# EAGLE schematic button (EAGLE 6.5.0)
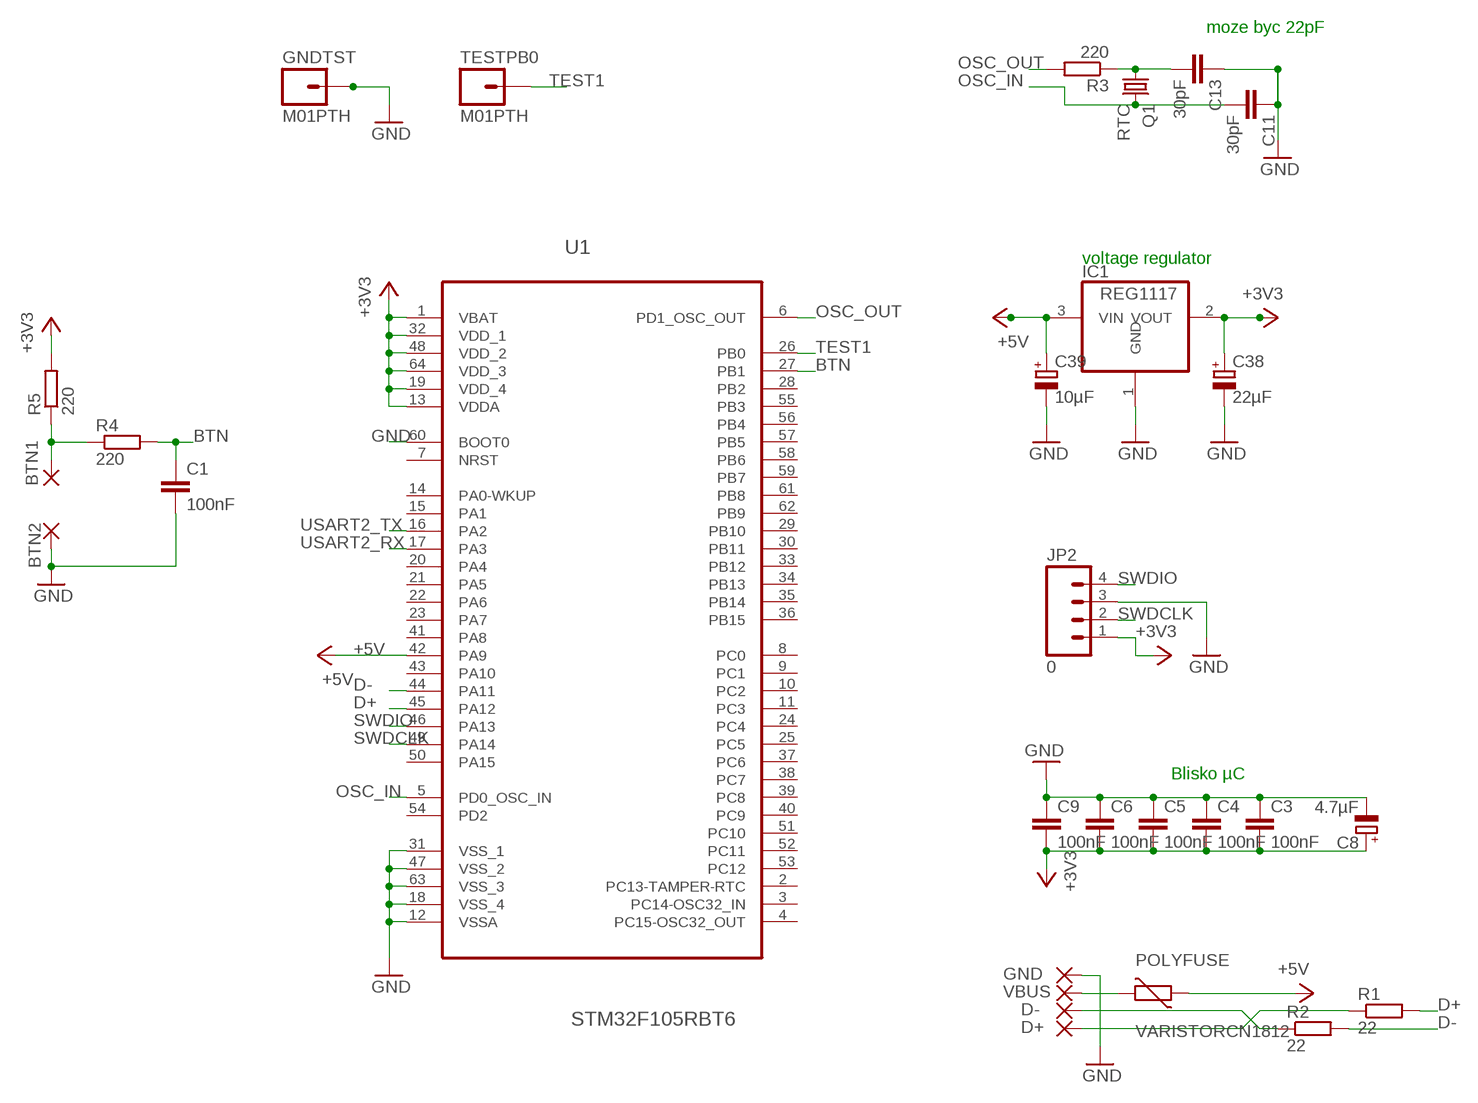
[diagram p0: schematic, sheet 1]

## Parts
BTN1  1,6/0,8  [1,6/0,8]
BTN2  1,6/0,8  [1,6/0,8]
C1  100nF  C-EUC0603  [C0603]
C3  100nF  C-EUC0603  [C0603]
C4  100nF  C-EUC0603  [C0603]
C5  100nF  C-EUC0603  [C0603]
C6  100nF  C-EUC0603  [C0603]
C8  4.7µF  CPOL-EUA/3216-18R  [A/3216-18R]
C9  100nF  C-EUC0603  [C0603]
C11  30pF  C-EUC0603  [C0603]
C13  30pF  C-EUC0603  [C0603]
C38  22µF  CPOL-EUB/3528-21W  [B/3528-21W]
C39  10µF  CPOL-EUB/3528-21W  [B/3528-21W]
D+  1,6/0,8  [1,6/0,8]
D-  1,6/0,8  [1,6/0,8]
GND  1,6/0,8  [1,6/0,8]
GNDTST  M01PTH  [1X01]
IC1  REG1117  [SOT223]
JP2  0  M04PTH  [1X04]
POLYFUSE  VARISTORCN1812  [CT/CN1812]
Q1  RTC  CRYSTALHC49S  [HC49/S]
R1  22  R-EU_R0805  [R0805]
R2  22  R-EU_R0805  [R0805]
R3  220  R-EU_R0603  [R0603]
R4  220  R-EU_R0603  [R0603]
R5  220  R-EU_R0603  [R0603]
TESTPB0  M01PTH  [1X01]
U1  STM32F105RBT6  [QFP50P1200X1200X160-64N]
VBUS  1,6/0,8  [1,6/0,8]

## Nets
+3V3: C3.2 C4.2 C5.2 C6.2 C8.+ C9.2 C38.+ IC1.2(VOUT) JP2.1 R5.2 U1.1(VBAT) U1.13(VDDA) U1.19(VDD_4) U1.32(VDD_1) U1.48(VDD_2) U1.64(VDD_3)
+5V: C39.+ IC1.3(VIN) POLYFUSE.1 U1.42(PA9)
BTN: C1.1 R4.2 U1.27(PB1)
D+: R1.2 U1.45(PA12)
D-: R2.2 U1.44(PA11)
GND: BTN2.1(P) C1.2 C3.1 C4.1 C5.1 C6.1 C8.- C9.1 C11.1 C13.1 C38.- C39.- GND.1(P) GNDTST.1 IC1.1(GND) JP2.3 U1.12(VSSA) U1.18(VSS_4) U1.31(VSS_1) U1.47(VSS_2) U1.60(BOOT0) U1.63(VSS_3)
N$1: C13.2 Q1.1 R3.1
N$2: BTN1.1(P) R4.1 R5.1
N$6: D+.1(P) R1.1
N$7: D-.1(P) R2.1
N$10: POLYFUSE.2 VBUS.1(P)
OSC_IN: C11.2 Q1.2 U1.5(PD0_OSC_IN)
OSC_OUT: R3.2 U1.6(PD1_OSC_OUT)
SWDCLK: JP2.2 U1.49(PA14)
SWDIO: JP2.4 U1.46(PA13)
TEST1: TESTPB0.1 U1.26(PB0)
USART2_RX: U1.17(PA3)
USART2_TX: U1.16(PA2)
Unconnected: U1.2(PC13-TAMPER-RTC) U1.3(PC14-OSC32_IN) U1.4(PC15-OSC32_OUT) U1.7(NRST) U1.8(PC0) U1.9(PC1) U1.10(PC2) U1.11(PC3) U1.14(PA0-WKUP) U1.15(PA1) U1.20(PA4) U1.21(PA5) U1.22(PA6) U1.23(PA7) U1.24(PC4) U1.25(PC5) U1.28(PB2) U1.29(PB10) U1.30(PB11) U1.33(PB12) U1.34(PB13) U1.35(PB14) U1.36(PB15) U1.37(PC6) U1.38(PC7) U1.39(PC8) U1.40(PC9) U1.41(PA8) U1.43(PA10) U1.50(PA15) U1.51(PC10) U1.52(PC11) U1.53(PC12) U1.54(PD2) U1.55(PB3) U1.56(PB4) U1.57(PB5) U1.58(PB6) U1.59(PB7) U1.61(PB8) U1.62(PB9)

## Notes on the sheet
- moze byc 22pF
- voltage regulator
- Blisko µC

## Library data of the parts
BTN1 BTN2 D+ D- GND VBUS = wirepad:1,6/0,8: THROUGH-HOLE PAD
C1 C3-C6 C9 C11 C13 = rcl:C-EU: CAPACITOR, European symbol
C8 C38 C39 = rcl:CPOL-EU: POLARIZED CAPACITOR, European symbol
GNDTST TESTPB0 = SparkFun-Connectors:M01: Header 1 Standard 1-pin 0.1" header. Use with straight break away headers (SKU : PRT-00116), right angle break away headers (PRT-00553), swiss pins (PRT-00743), machine pins (PRT-00117), and female headers (PRT-00115).
IC1 = burr-brown:REG1117: 800mA and 1A Low Dropout (LDO) Positive Regulator 1.8V, 2.5V, 2.85V, 3.3V, 5V, and Adj; MPN: REG1117; OC_FARNELL: 1097566; OC_NEWARK: 14P6981
JP2 = SparkFun-Connectors:M04: Header 4 Standard 4-pin 0.1" header. Use with straight break away headers (SKU : PRT-00116), right angle break away headers (PRT-00553), swiss pins (PRT-00743), machine pins (PRT-00117), and female headers (PRT-00115). Molex polarized connector foot print use with SKU : PRT-08231 with associated crimp pins and housings. 1MM SMD Version SKU: PRT-10208
POLYFUSE = varistor:VARISTOR: VARISTOR
Q1 = crystal:CRYSTAL: CRYSTAL; OC_FARNELL: 1667008; OC_NEWARK: unknown
R1 R2 = resistor:R-EU_: RESISTOR, European symbol
R3-R5 = rcl:R-EU_: RESISTOR, European symbol
U1 = iwasz-logo:STM32F105RBT6: ARM-based 32-bit MCU; MPN: STM32F105RBT6; OC_FARNELL: 1737133; OC_NEWARK: 25R9437; PACKAGE: LQFP-64; SUPPLIER: STMicroelectronics